# EAGLE schematic Power_5vto3_3_MIC5205 (EAGLE 6.1)
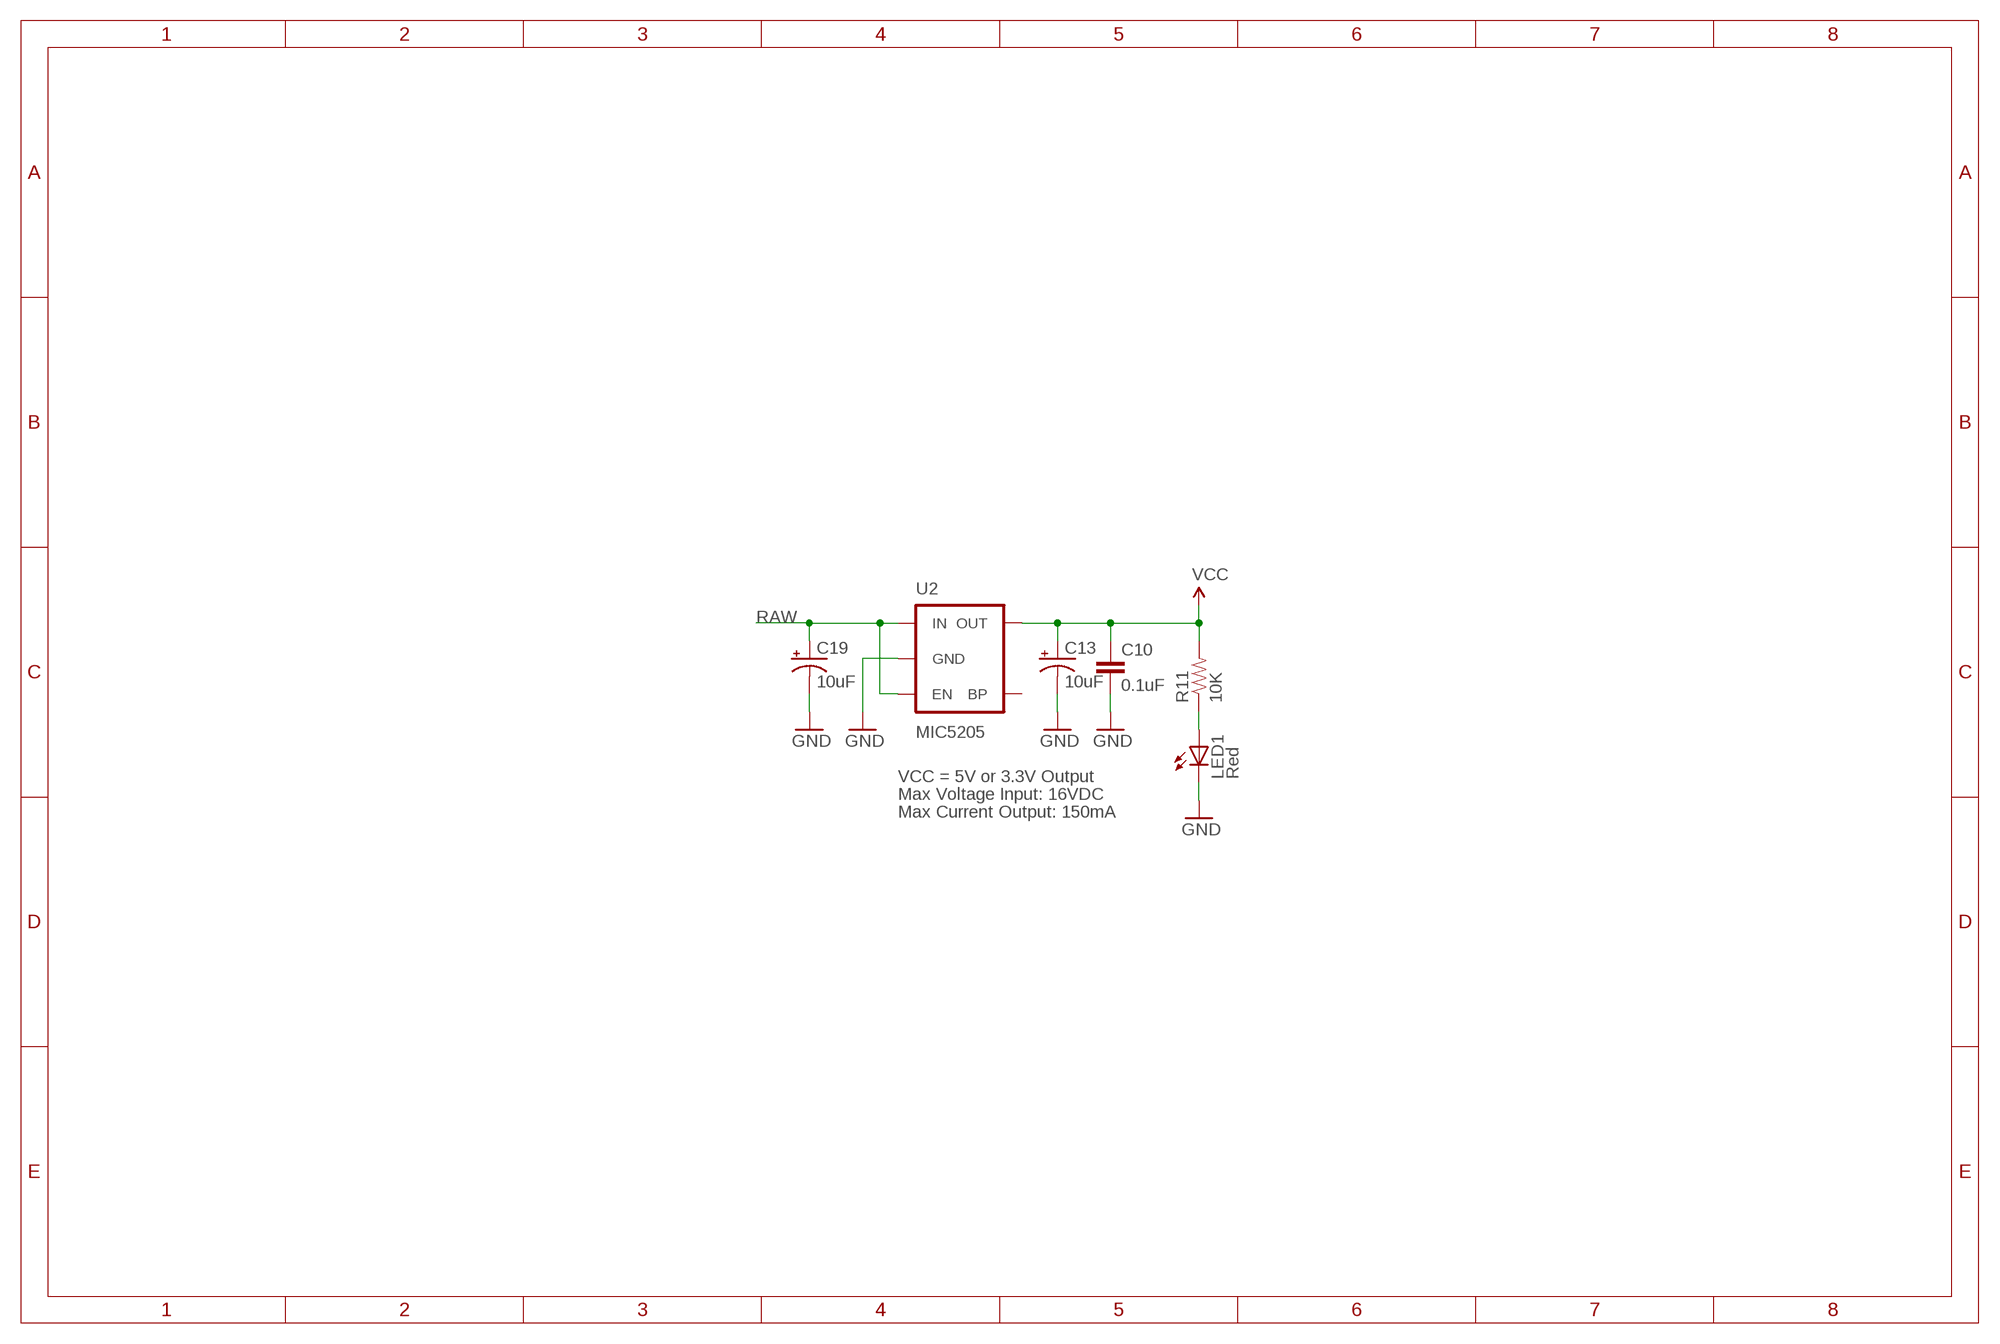
[diagram p0: schematic, sheet 1]

## Parts
C10  0.1uF  CAP0402-CAP  [0402-CAP]
C13  10uF  CAP_POL1206  [EIA3216]
C19  10uF  CAP_POL1206  [EIA3216]
LED1  Red  LED0603  [LED-0603]
R11  10K  RESISTOR0402-RES  [0402-RES]
U2  MIC5205  V_REG_LDOSMD  [SOT23-5]

## Nets
GND [power]: C10.2 C13.C(-) C19.C(-) LED1.C U2.2(GND)
N$38: LED1.A R11.1
RAW [power]: C19.A(+) U2.1(IN) U2.3(EN)
VCC: C10.1 C13.A(+) R11.2 U2.5(OUT)
Unconnected: U2.4(BP)

## Notes on the sheet
- VCC = 5V or 3.3V Output
- Max Voltage Input: 16VDC
- Max Current Output: 150mA

## Library data of the parts
C10 = SparkFun:CAP: Capacitor Standard 0603 ceramic capacitor, and 0.1" leaded capacitor.
C13 C19 = SparkFun:CAP_POL: Capacitor Polarized These are standard SMD and PTH capacitors. Normally 10uF, 47uF, and 100uF in electrolytic and tantalum varieties. Always verify the external diameter of the through hole cap, it varies with capacity, voltage, and manufacturer. The EIA devices should be standard.
LED1 = SparkFun:LED: LEDs Standard schematic elements and footprints for 5mm, 3mm, 1206, and 0603 sized LEDs. 5mm - Spark Fun Electronics SKU : COM-00529 (and others)
R11 = SparkFun:RESISTOR: Resistor Basic schematic elements and footprints for 0603, 1206, and PTH resistors.
U2 = SparkFun:V_REG_LDO: Voltage Regulator LDO Standard 150mA LDO voltage regulator in SOT-23 layout. Micrel part MIC5205. BP (by-pass) pin is used to lower output noise with 470pF cap.

## Net classes
0 default: width 0.203 mm
1 power: width 0.254 mm